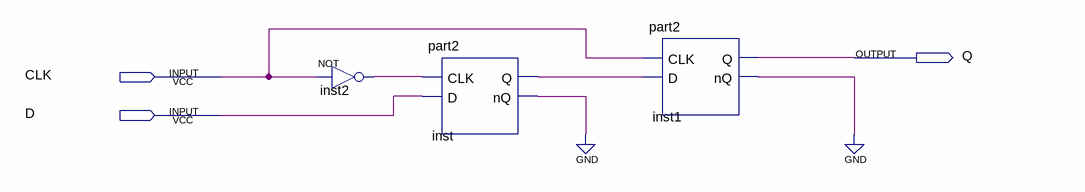
[diagram p0: schematic sheet]
// Quartus schematic part3.bdf as structural Verilog: 3 symbols, 3 pins
module part3 (
  input  CLK,
  input  D,
  output Q
);

  wire inst1_nq, inst2_out, inst_nq, inst_q;

  not inst2 (inst2_out, CLK);
  part2 inst (.CLK(inst2_out), .D(D), .Q(inst_q), .nQ(inst_nq));
  part2 inst1 (.CLK(CLK), .D(inst_q), .Q(Q), .nQ(inst1_nq));
  // also tied to GND on the sheet: {inst_nq, inst1_nq}
endmodule
